# EAGLE schematic dongle (EAGLE 9.6.2)
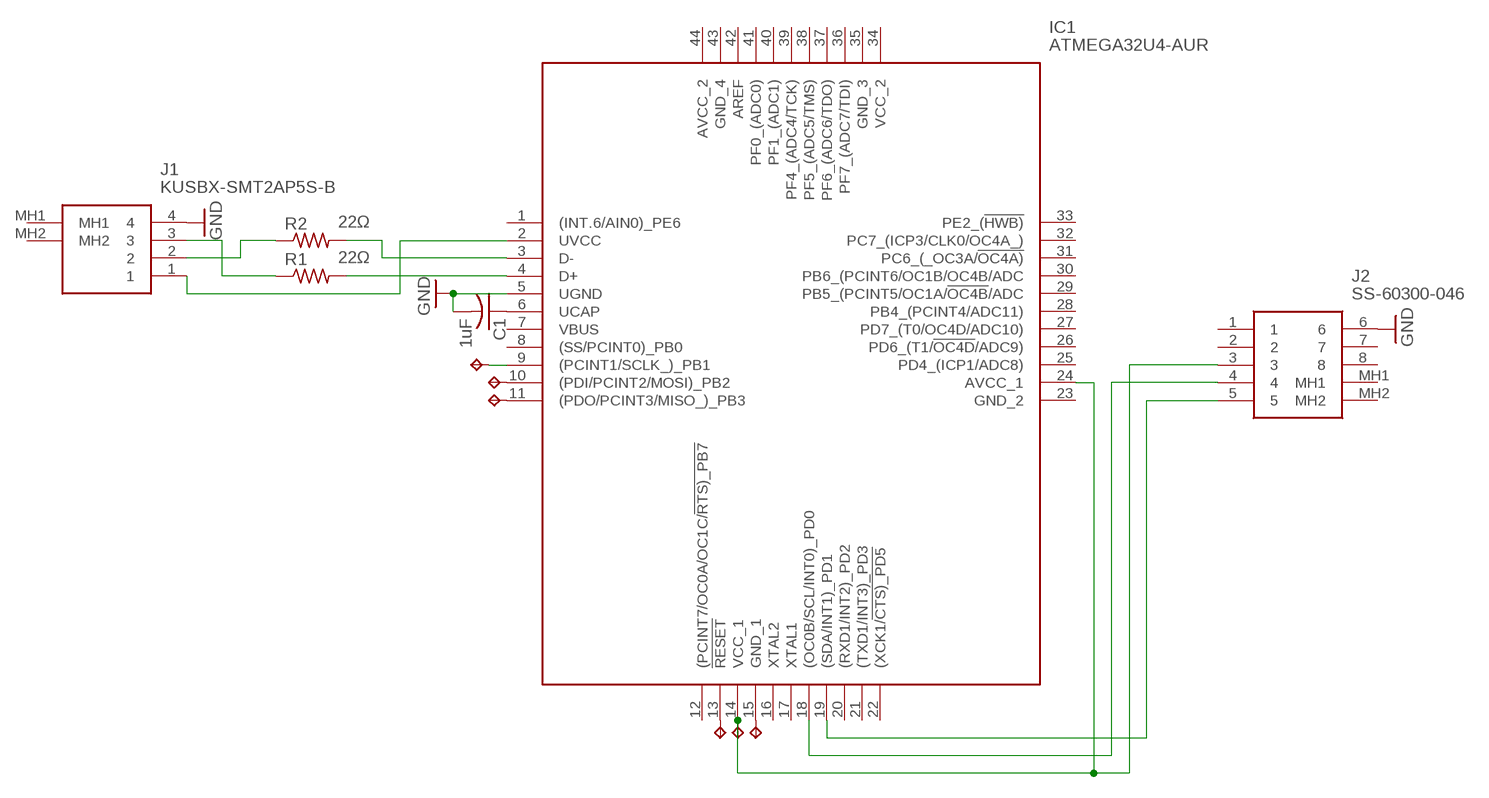
[diagram p0: schematic, sheet 1]

## Parts
5V  TPTP17R  [TP17R]
C1  1uF  C-USC0805  [C0805]
GND  TPTP17R  [TP17R]
IC1  ATMEGA32U4-AUR  [QFP80P1200X1200X120-44N]
J1  KUSBX-SMT2AP5S-B  [KUSBXSMT2AP5SB]
J2  SS-60300-046  [SS60300046]
MISO  TPTP17R  [TP17R]
MOSI  TPTP17R  [TP17R]
R1  22Ω  R-US_R0805  [R0805]
R2  22Ω  R-US_R0805  [R0805]
RST  TPTP17R  [TP17R]
SCLK  TPTP17R  [TP17R]

## Nets
CLK: IC1.19((SDA/INT1)_PD1) J2.5
D+: J1.3 R1.1
D+RES: IC1.4(D+) R1.2
D-: J1.2 R2.1
D-RES: IC1.3(D-) R2.2
DATA: IC1.18((OC0B/SCL/INT0)_PD0) J2.4
GND: C1.2 GND.TP IC1.5(UGND) IC1.15(GND_1) J1.4 J2.6
MISO: IC1.11((PDO/PCINT3/MISO_)_PB3) MISO.TP
MOSI: IC1.10((PDI/PCINT2/MOSI)_PB2) MOSI.TP
RST: IC1.13(!RESET) RST.TP
SCLK: IC1.9((PCINT1/SCLK_)_PB1) SCLK.TP
UCAP: C1.1 IC1.6(UCAP)
VCC: 5V.TP IC1.14(VCC_1) IC1.24(AVCC_1) J2.3
VIN: IC1.2(UVCC) J1.1
Unconnected: IC1.1((INT.6/AIN0)_PE6) IC1.7(VBUS) IC1.8((SS/PCINT0)_PB0) IC1.12((PCINT7/OC0A/OC1C/!RTS)_PB7) IC1.16(XTAL2) IC1.17(XTAL1) IC1.20((RXD1/INT2)_PD2) IC1.21((TXD1/INT3)_PD3) IC1.22((XCK1/!CTS)_PD5) IC1.23(GND_2) IC1.25(PD4_(ICP1/ADC8)) IC1.26(PD6_(T1/!OC4D!/ADC9)) IC1.27(PD7_(T0/OC4D/ADC10)) IC1.28(PB4_(PCINT4/ADC11)) IC1.29(PB5_(PCINT5/OC1A/!OC4B!/ADC) IC1.30(PB6_(PCINT6/OC1B/OC4B/ADC) IC1.31(PC6_(_OC3A/!OC4A)) IC1.32(PC7_(ICP3/CLK0/OC4A_)) IC1.33(PE2_(!HWB)) IC1.34(VCC_2) IC1.35(GND_3) IC1.36(PF7_(ADC7/TDI)) IC1.37(PF6_(ADC6/TDO)) IC1.38(PF5_(ADC5/TMS)) IC1.39(PF4_(ADC4/TCK)) IC1.40(PF1_(ADC1)) IC1.41(PF0_(ADC0)) IC1.42(AREF) IC1.43(GND_4) IC1.44(AVCC_2) J1.MH1 J1.MH2 J2.1 J2.2 J2.7 J2.8 J2.MH1 J2.MH2

## Library data of the parts
5V GND MISO MOSI RST SCLK = testpad:TP: Test pad
C1 = adafruit:C-US: CAPACITOR, American symbol
IC1 = SamacSys_Parts:ATMEGA32U4-AUR: 8-bit Microcontrollers - MCU USB 32K Flash 16 MHz Source: Datasheet; DESCRIPTION: 8-bit Microcontrollers - MCU USB 32K Flash 16 MHz; HEIGHT: 1.2mm; MANUFACTURER_NAME: Microchip; MANUFACTURER_PART_NUMBER: ATMEGA32U4-AUR; MOUSER_PART_NUMBER: 556-ATMEGA32U4-AUR; MOUSER_PRICE-STOCK: https://www.mouser.co.uk/ProductDetail/Microchip-Technology-Atmel/ATMEGA32U4-AUR?qs=rBGENRD8NwIbVIAimLns%252BA%3D%3D
J1 = SamacSys_Parts:KUSBX-SMT2AP5S-B: USB Connectors A TYPE SMT BLK PLUG 1.35mm POSTS SHIELD Source: Datasheet <http://www.kycon.com/Pub_Eng_Draw/KUSBX-SMT2AP5S-X.pdf>; DESCRIPTION: USB Connectors A TYPE SMT BLK PLUG 1.35mm POSTS SHIELD; HEIGHT: 4.75mm; MANUFACTURER_NAME: Kycon; MANUFACTURER_PART_NUMBER: KUSBX-SMT2AP5S-B; MOUSER_PART_NUMBER: 806-KUSBXSMT2AP5SB; MOUSER_PRICE-STOCK: https://www.mouser.co.uk/ProductDetail/Kycon/KUSBX-SMT2AP5S-B/?qs=7zcQ9RRVJlhCJlshlB7IBQ%3D%3D
J2 = SamacSys_Parts:SS-60300-046: Ethernet Connectors R ANG SHIELDED JACK ;SS60300046 Source: Datasheet <https://www.mouser.de/datasheet/2/643/dr-STW-SS-60300-046-1596894.pdf>; DESCRIPTION: Ethernet Connectors R ANG SHIELDED JACK ;SS60300046; HEIGHT: 14.33mm; MANUFACTURER_NAME: Bel; MANUFACTURER_PART_NUMBER: SS-60300-046; MOUSER_PART_NUMBER: 530-SS-60300-046
R1 R2 = adafruit:R-US_: RESISTOR, American symbol